# EAGLE schematic Heated Bed (EAGLE 7.2.0)
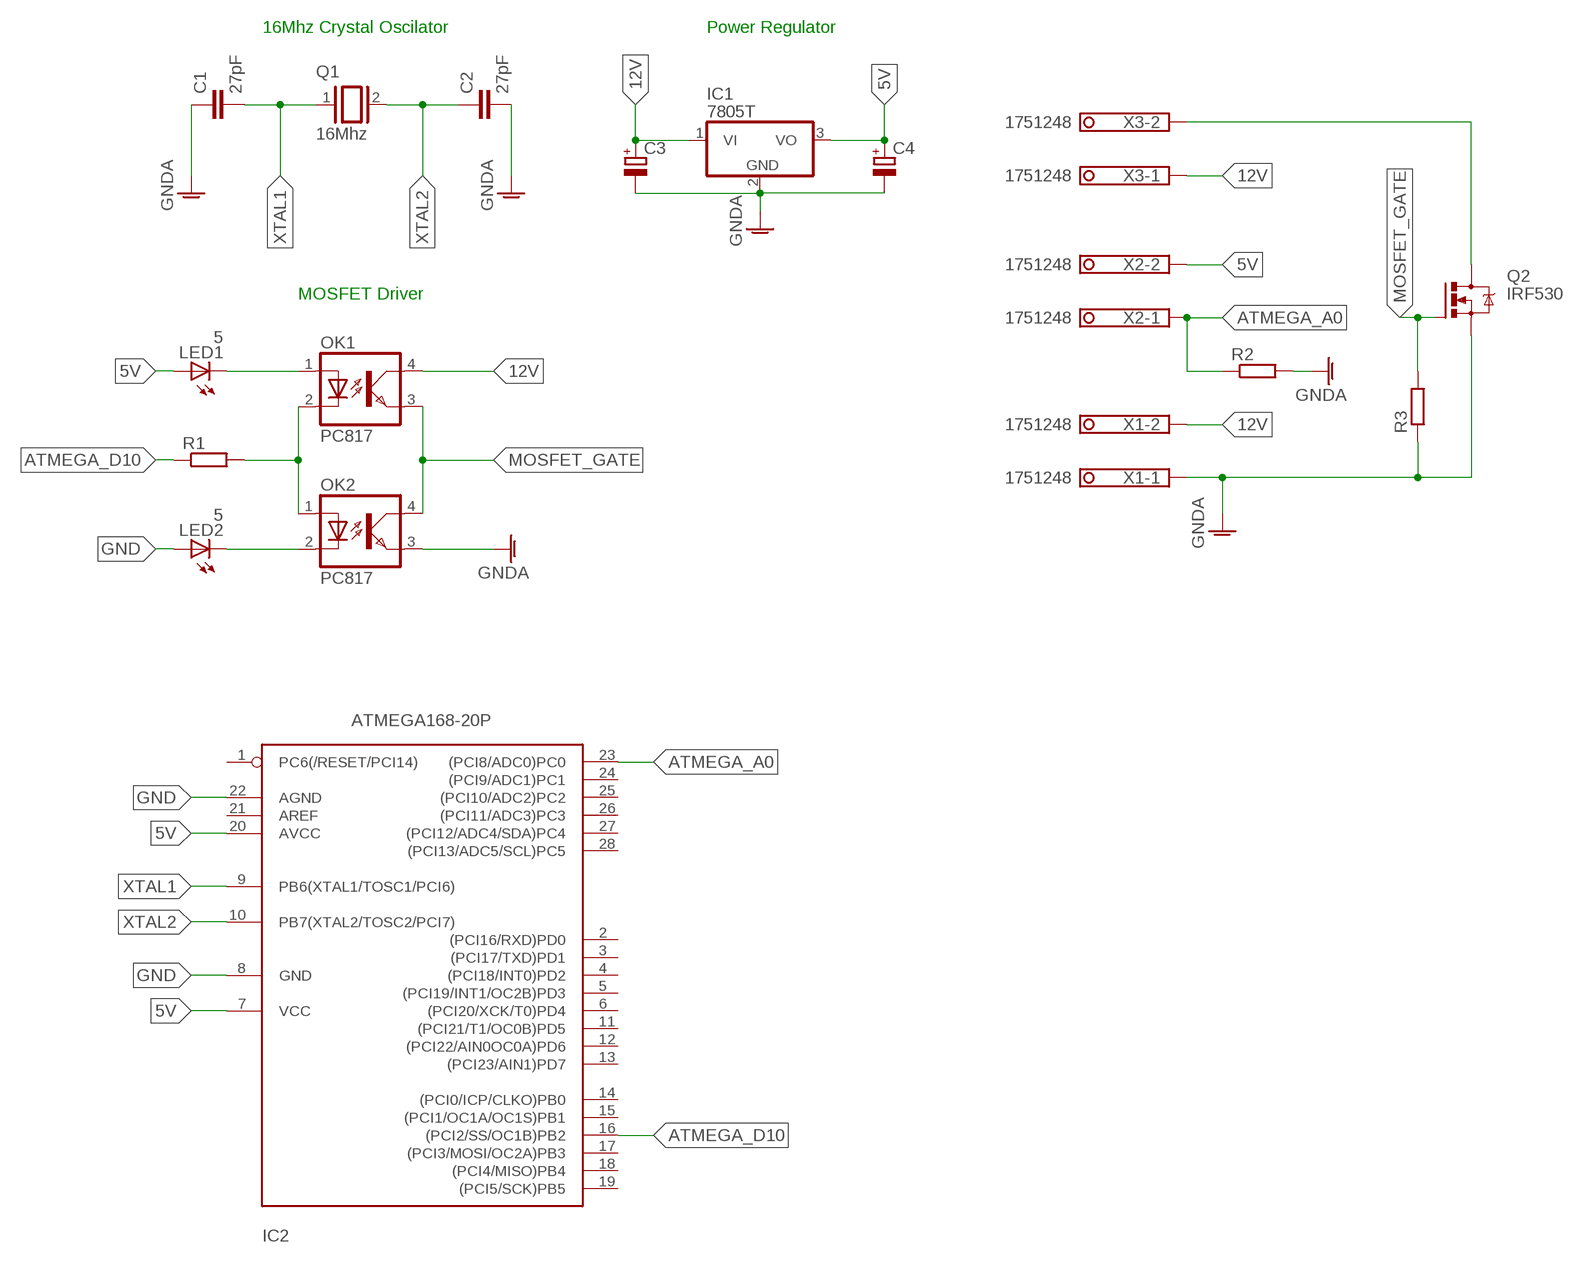
[diagram p0: schematic, sheet 1]

## Parts
C1  27pF  C-EU025-025X050  [C025-025X050]
C2  27pF  C-EU025-025X050  [C025-025X050]
C3  CPOL-EUE5-10.5  [E5-10,5]
C4  CPOL-EUE5-10.5  [E5-10,5]
IC1  7805T  [TO220H]
IC2  ATMEGA168-20P  [DIL28-3]
LED1  5  LED5MM  [LED5MM]
LED2  5  LED5MM  [LED5MM]
OK1  PC817  [DIL04]
OK2  PC817  [DIL04]
Q1  16Mhz  XTAL/S  [QS]
Q2  IRF530  [TO220BV]
R1  R-EU_0207/7  [0207/7]
R2  R-EU_0207/7  [0207/7]
R3  R-EU_0207/7  [0207/7]
X1  1751248  [1751248]
X2  1751248  [1751248]
X3  1751248  [1751248]

## Nets
5V: C4.+ IC1.3(VO) IC2.7(VCC) IC2.20(AVCC) LED1.A X2.2
12V [supply]: C3.+ IC1.1(VI) OK1.4(COL) X1.2 X3.1
ATMEGA_A0: IC2.23((PCI8/ADC0)PC0) R2.1 X2.1
ATMEGA_D10: IC2.16((PCI2/SS/OC1B)PB2) R1.1
GND: C1.1 C2.2 C3.- C4.- IC1.2(GND) IC2.8(GND) IC2.22(AGND) LED2.A OK2.3(EMIT) Q2.S R2.2 R3.1 X1.1 ; supply symbol labelled GNDA
MOSFET_GATE: OK1.3(EMIT) OK2.4(COL) Q2.G R3.2
N$1: LED1.K(C) OK1.1(A)
N$2: OK1.2(C) OK2.1(A) R1.2
N$3: LED2.K(C) OK2.2(C)
N$5: Q2.D X3.2
XTAL1: C1.2 IC2.9(PB6(XTAL1/TOSC1/PCI6)) Q1.1
XTAL2: C2.1 IC2.10(PB7(XTAL2/TOSC2/PCI7)) Q1.2
Unconnected: IC2.1(PC6(/RESET/PCI14)) IC2.2((PCI16/RXD)PD0) IC2.3((PCI17/TXD)PD1) IC2.4((PCI18/INT0)PD2) IC2.5((PCI19/INT1/OC2B)PD3) IC2.6((PCI20/XCK/T0)PD4) IC2.11((PCI21/T1/OC0B)PD5) IC2.12((PCI22/AIN0OC0A)PD6) IC2.13((PCI23/AIN1)PD7) IC2.14((PCI0/ICP/CLKO)PB0) IC2.15((PCI1/OC1A/OC1S)PB1) IC2.17((PCI3/MOSI/OC2A)PB3) IC2.18((PCI4/MISO)PB4) IC2.19((PCI5/SCK)PB5) IC2.21(AREF) IC2.24((PCI9/ADC1)PC1) IC2.25((PCI10/ADC2)PC2) IC2.26((PCI11/ADC3)PC3) IC2.27((PCI12/ADC4/SDA)PC4) IC2.28((PCI13/ADC5/SCL)PC5)

## Notes on the sheet
- 16Mhz Crystal Oscilator | Power Regulator
- MOSFET Driver

## Library data of the parts
C1 C2 = rcl:C-EU: CAPACITOR, European symbol
C3 C4 = rcl:CPOL-EU: POLARIZED CAPACITOR, European symbol
IC1 = linear:78*: Positive VOLTAGE REGULATOR Source: http://cache.national.com/ds/LM/LM78L05.pdf http://www.fairchildsemi.com/ds/LM/LM7805.pdf
IC2 = adafruit:ATMEGA168*P: MICROCONTROLLER 16 kBytes FLASH 1 kBytes SRAM 512 Bytes EEPROM USART 8-channel 10 bit ADC
LED1 LED2 = adafruit:LED: LED OSRAM: - CHIPLED LG R971, LG N971, LY N971, LG Q971, LY Q971, LO R971, LY R971 LH N974, LH R974 LS Q976, LO Q976, LY Q976 LO Q996 - Hyper CHIPLED LW Q18S LB Q993, LB Q99A, LB R99A - SideLED LS A670, LO A670, LY A670, LG A670, LP A670 LB A673, LV A673, LT A673, LW A673 LH A674 LY A675 LS A676, LA A676, LO A676, LY A676, LW A676 LS A679, LY A679, LG A679 - Hyper Micro SIDELED® LS Y876, LA Y876, LO Y876, LY Y876 LT Y87S - SmartLED LW L88C, LW L88S LB L89C, LB L89S, LG L890 LS L89K, LO L89K, LY L89K LS L896, LA L896, LO L896, LY L896 - TOPLED LS T670, LO T670, LY T670, LG T670, LP T670 LSG T670, LSP T670, LSY T670, LOP T670, LYG T670 LG T671, LOG T671, LSG T671 LB T673, LV T673, LT T673, LW T673 LH T674 LS T676, LA T676, LO T676, LY T676, LB T676, LH T676, LSB T676, LW T676 LB T67C, LV T67C, LT T67C, LS T67K, LO T67K, LY T67K, LW E67C LS E67B, LA E67B, LO E67B, LY E67B, LB E67C, LV E67C, LT E67C LW T67C LS T679, LY T679, LG T679 LS T770, LO T770, LY T770, LG T770, LP T770 LB T773, LV T773, LT T773, LW T773 LH T774 LS E675, LA E675, LY E675, LS T675 LS T776, LA T776, LO T776, LY T776, LB T776 LHGB T686 LT T68C, LB T68C - Hyper Mini TOPLED® LB M676 - Mini TOPLED Santana® LG M470 LS M47K, LO M47K, LY M47K Source: http://www.osram.convergy.de/
OK1 OK2 = optocoupler:PC817: SHARP OPTO COUPLER; MPN: PC817X4J000F; OC_FARNELL: 9707727; OC_NEWARK: 97K7059
Q1 = special:XTAL/S: CRYSTAL
Q2 = transistor-power:IRF530: HEXFET Power MOSFET
R1-R3 = rcl:R-EU_: RESISTOR, European symbol
X1-X3 = con-phoenix-350:1751248: MKDS 1/ 2-3,5 Printklemme Nennstrom: 10 A Bemessungsspannung: 160 V Raster: 3,5 mm Polzahl: 2 Montageart: Löten Anschlussart: Schraubanschluss Anschlussrichtung vom Leiter zur Platine: 0° Source: http://eshop.phoenixcontact.com .. 1751248.pdf; OC_FARNELL: unknown; OC_NEWARK: unknown

## Net classes
0 default: width 0.559 mm
1 supply: width 1.143 mm, clearance 1.143 mm